# EAGLE design CocoLink (EAGLE 7.7.0)

## Sheet 1 of 4: LOGIC
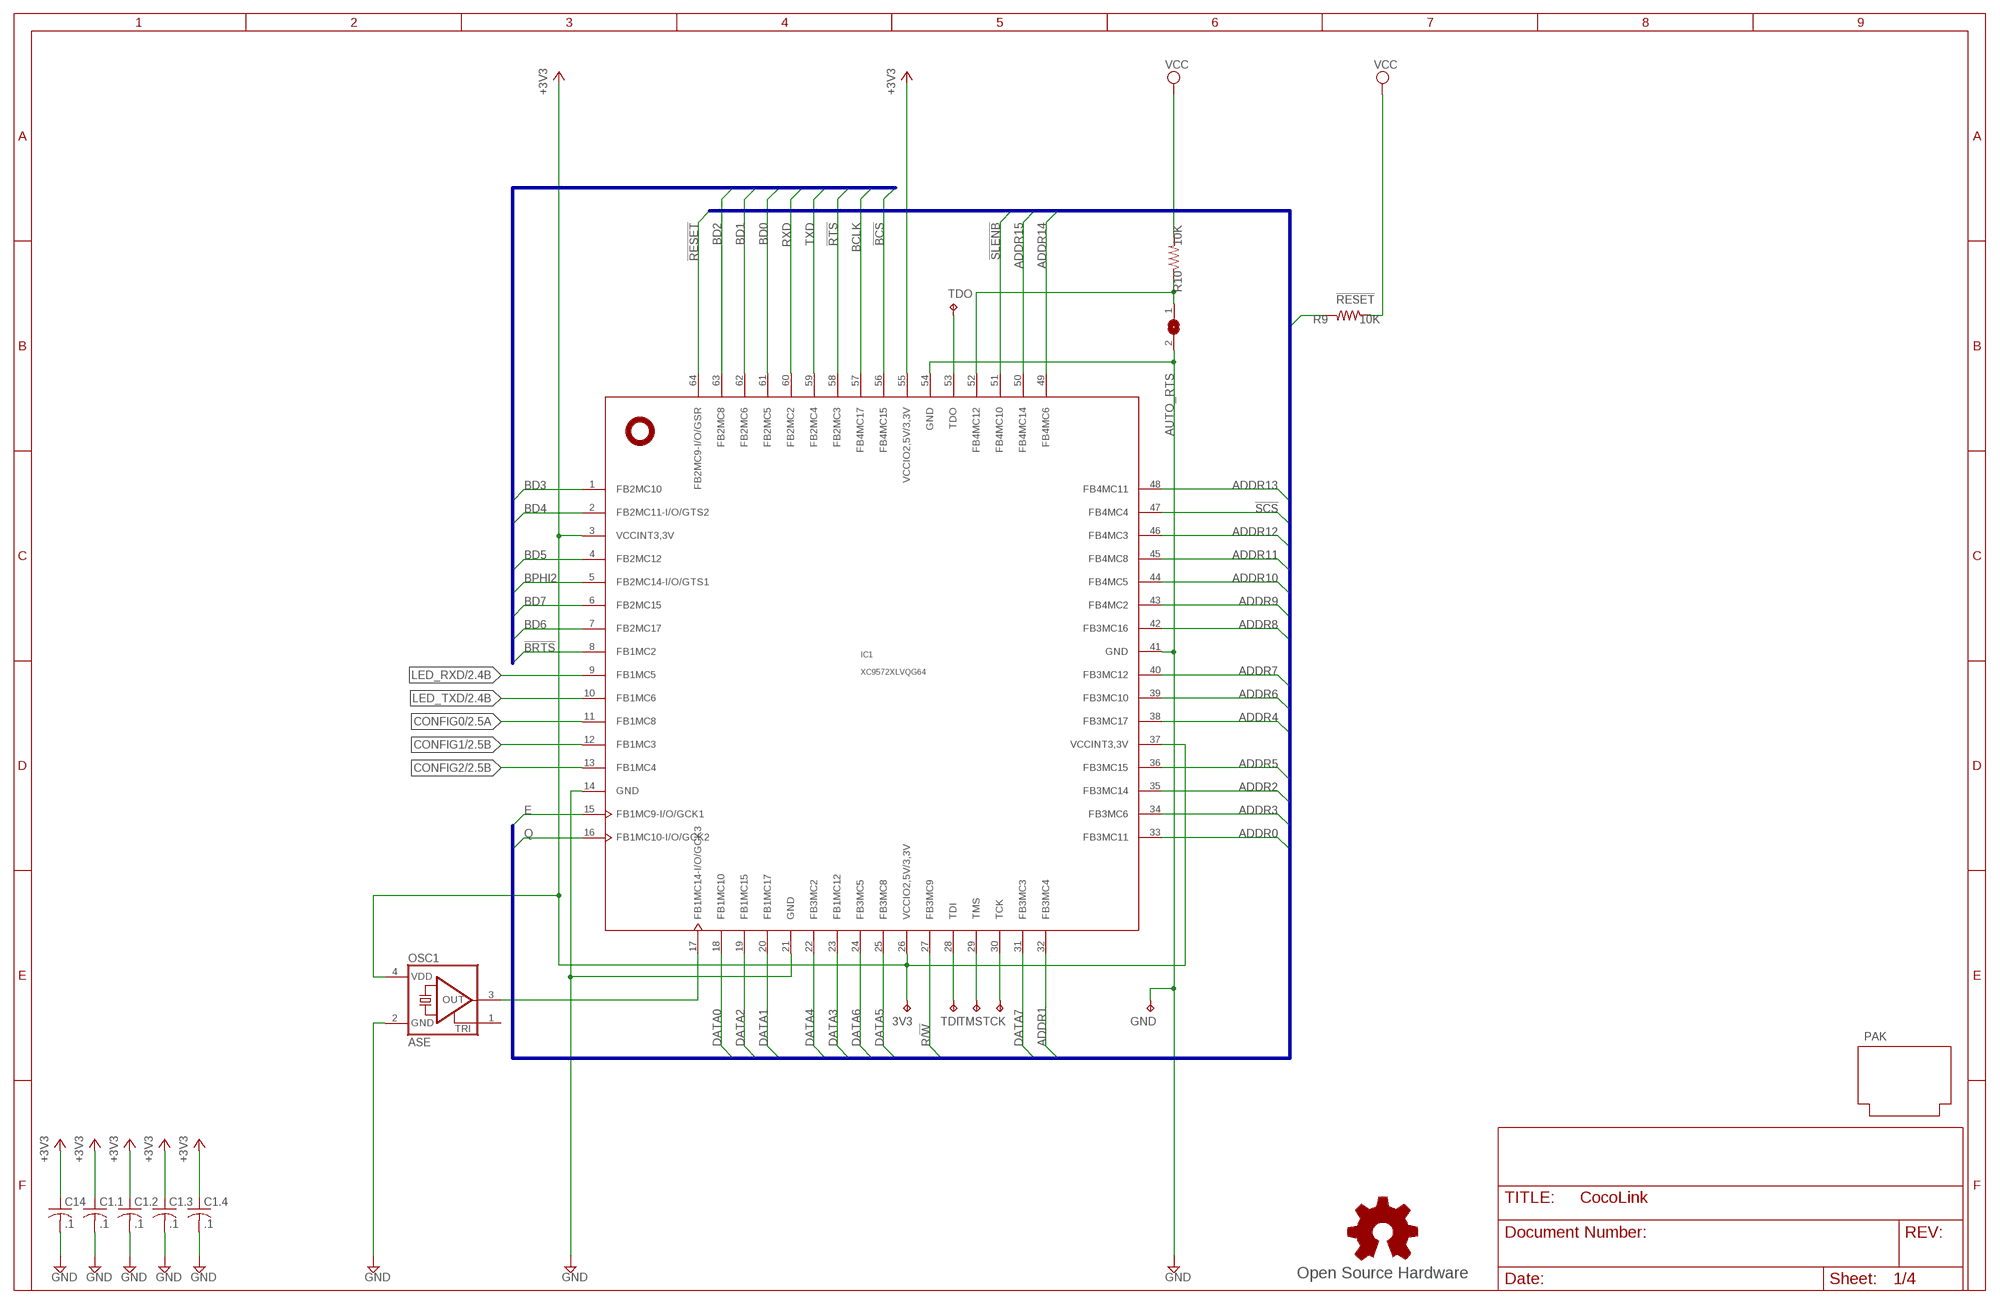
[diagram p0: schematic, sheet 1]

### Parts
3V3  TPTP10R  [TP10R]
AUTO_RTS  SJ  [SJ]
C1.1  .1  C-USC0402  [C0402]
C1.2  .1  C-USC0402  [C0402]
C1.3  .1  C-USC0402  [C0402]
C1.4  .1  C-USC0402  [C0402]
C14  .1  C-USC0402  [C0402]
GND  TPTP10R  [TP10R]
GOLD_ORB_SM1  Open Source Hardware  OSHWLOGOLOGO8MM  [OSHW_8MM]
IC1  XC9572XLVQG64  [VQFP64]
OSC1  ASE  [ASE]
PAK  PROGRAM_PAK  [PROGRAM_PAK]
R9  10K  R-US_R0402  [R0402]
R10  10K  R-US_R0402  [R0402]
TCK  TPTP10R  [TP10R]
TDI  TPTP10R  [TP10R]
TDO  TPTP10R  [TP10R]
TMS  TPTP10R  [TP10R]

### Nets
!BCS: IC1.56(FB4MC15) ; also sheet 3
!BRTS: IC1.8(FB1MC2) ; also sheet 3
!RESET: IC1.64(FB2MC9-I/O/GSR) R9.1 ; also sheet 2,3
!RTS: IC1.58(FB2MC3) ; also sheet 3
!SCS: IC1.47(FB4MC4) ; also sheet 2
!SLENB: IC1.51(FB4MC10) ; also sheet 2
+3V3: 3V3.TP C1.1.1 C1.2.1 C1.3.1 C1.4.1 C14.1 IC1.3(VCCINT3,3V) IC1.26(VCCIO2,5V/3,3V) IC1.37(VCCINT3,3V) IC1.55(VCCIO2,5V/3,3V) OSC1.4(VDD) ; also sheet 2,4
ADDR0: IC1.33(FB3MC11) ; also sheet 2,3
ADDR1: IC1.32(FB3MC4) ; also sheet 2,3
ADDR2: IC1.35(FB3MC14) ; also sheet 2
ADDR3: IC1.34(FB3MC6) ; also sheet 2
ADDR4: IC1.38(FB3MC17) ; also sheet 2
ADDR5: IC1.36(FB3MC15) ; also sheet 2
ADDR6: IC1.39(FB3MC10) ; also sheet 2
ADDR7: IC1.40(FB3MC12) ; also sheet 2
ADDR8: IC1.42(FB3MC16) ; also sheet 2
ADDR9: IC1.43(FB4MC2) ; also sheet 2
ADDR10: IC1.44(FB4MC5) ; also sheet 2
ADDR11: IC1.45(FB4MC8) ; also sheet 2
ADDR12: IC1.46(FB4MC3) ; also sheet 2
ADDR13: IC1.48(FB4MC11) ; also sheet 2
ADDR14: IC1.49(FB4MC6) ; also sheet 2
ADDR15: IC1.50(FB4MC14) ; also sheet 2
BCLK: IC1.57(FB4MC17) ; also sheet 3
BD0: IC1.61(FB2MC5) ; also sheet 3
BD1: IC1.62(FB2MC6) ; also sheet 3
BD2: IC1.63(FB2MC8) ; also sheet 3
BD3: IC1.1(FB2MC10) ; also sheet 3
BD4: IC1.2(FB2MC11-I/O/GTS2) ; also sheet 3
BD5: IC1.4(FB2MC12) ; also sheet 3
BD6: IC1.7(FB2MC17) ; also sheet 3
BD7: IC1.6(FB2MC15) ; also sheet 3
BPHI2: IC1.5(FB2MC14-I/O/GTS1) ; also sheet 3
CONFIG0: IC1.11(FB1MC8) ; also sheet 2
CONFIG1: IC1.12(FB1MC3) ; also sheet 2
CONFIG2: IC1.13(FB1MC4) ; also sheet 2
DATA0: IC1.18(FB1MC10) ; also sheet 2
DATA1: IC1.20(FB1MC17) ; also sheet 2
DATA2: IC1.19(FB1MC15) ; also sheet 2
DATA3: IC1.23(FB1MC12) ; also sheet 2
DATA4: IC1.22(FB3MC2) ; also sheet 2
DATA5: IC1.25(FB3MC8) ; also sheet 2
DATA6: IC1.24(FB3MC5) ; also sheet 2
DATA7: IC1.31(FB3MC3) ; also sheet 2
E: IC1.15(FB1MC9-I/O/GCK1) ; also sheet 2
GND: AUTO_RTS.2 C1.1.2 C1.2.2 C1.3.2 C1.4.2 C14.2 GND.TP IC1.14(GND) IC1.21(GND) IC1.41(GND) IC1.54(GND) OSC1.2(GND) ; also sheet 2,3,4
LED_RXD: IC1.9(FB1MC5) ; also sheet 2
LED_TXD: IC1.10(FB1MC6) ; also sheet 2
N$1: IC1.53(TDO) TDO.TP
N$2: IC1.28(TDI) TDI.TP
N$3: IC1.29(TMS) TMS.TP
N$4: IC1.30(TCK) TCK.TP
N$7: IC1.17(FB1MC14-I/O/GCK3) OSC1.3(OUT)
N$14: AUTO_RTS.1 IC1.52(FB4MC12) R10.1
Q: IC1.16(FB1MC10-I/O/GCK2) ; also sheet 2
R/!W: IC1.27(FB3MC9) ; also sheet 2,3
RXD: IC1.60(FB2MC2) ; also sheet 3
TXD: IC1.59(FB2MC4) ; also sheet 3
VCC: R9.2 R10.2 ; also sheet 3,4
Unconnected: OSC1.1(TRI)

### Buses
ADDR[0..15],DATA[0..7],R/!W,!NMI,!RESET,E,Q,!SLENB,!HALT,SND,!CART,!SCS,!CTS
!BRESET,BD[0..7],RS[0..1],!BIRQ,!BR/W,!BCS,BCLK,BPHI2,TXD,RXD,!RTS,!BRTS

## Sheet 2 of 4: IO
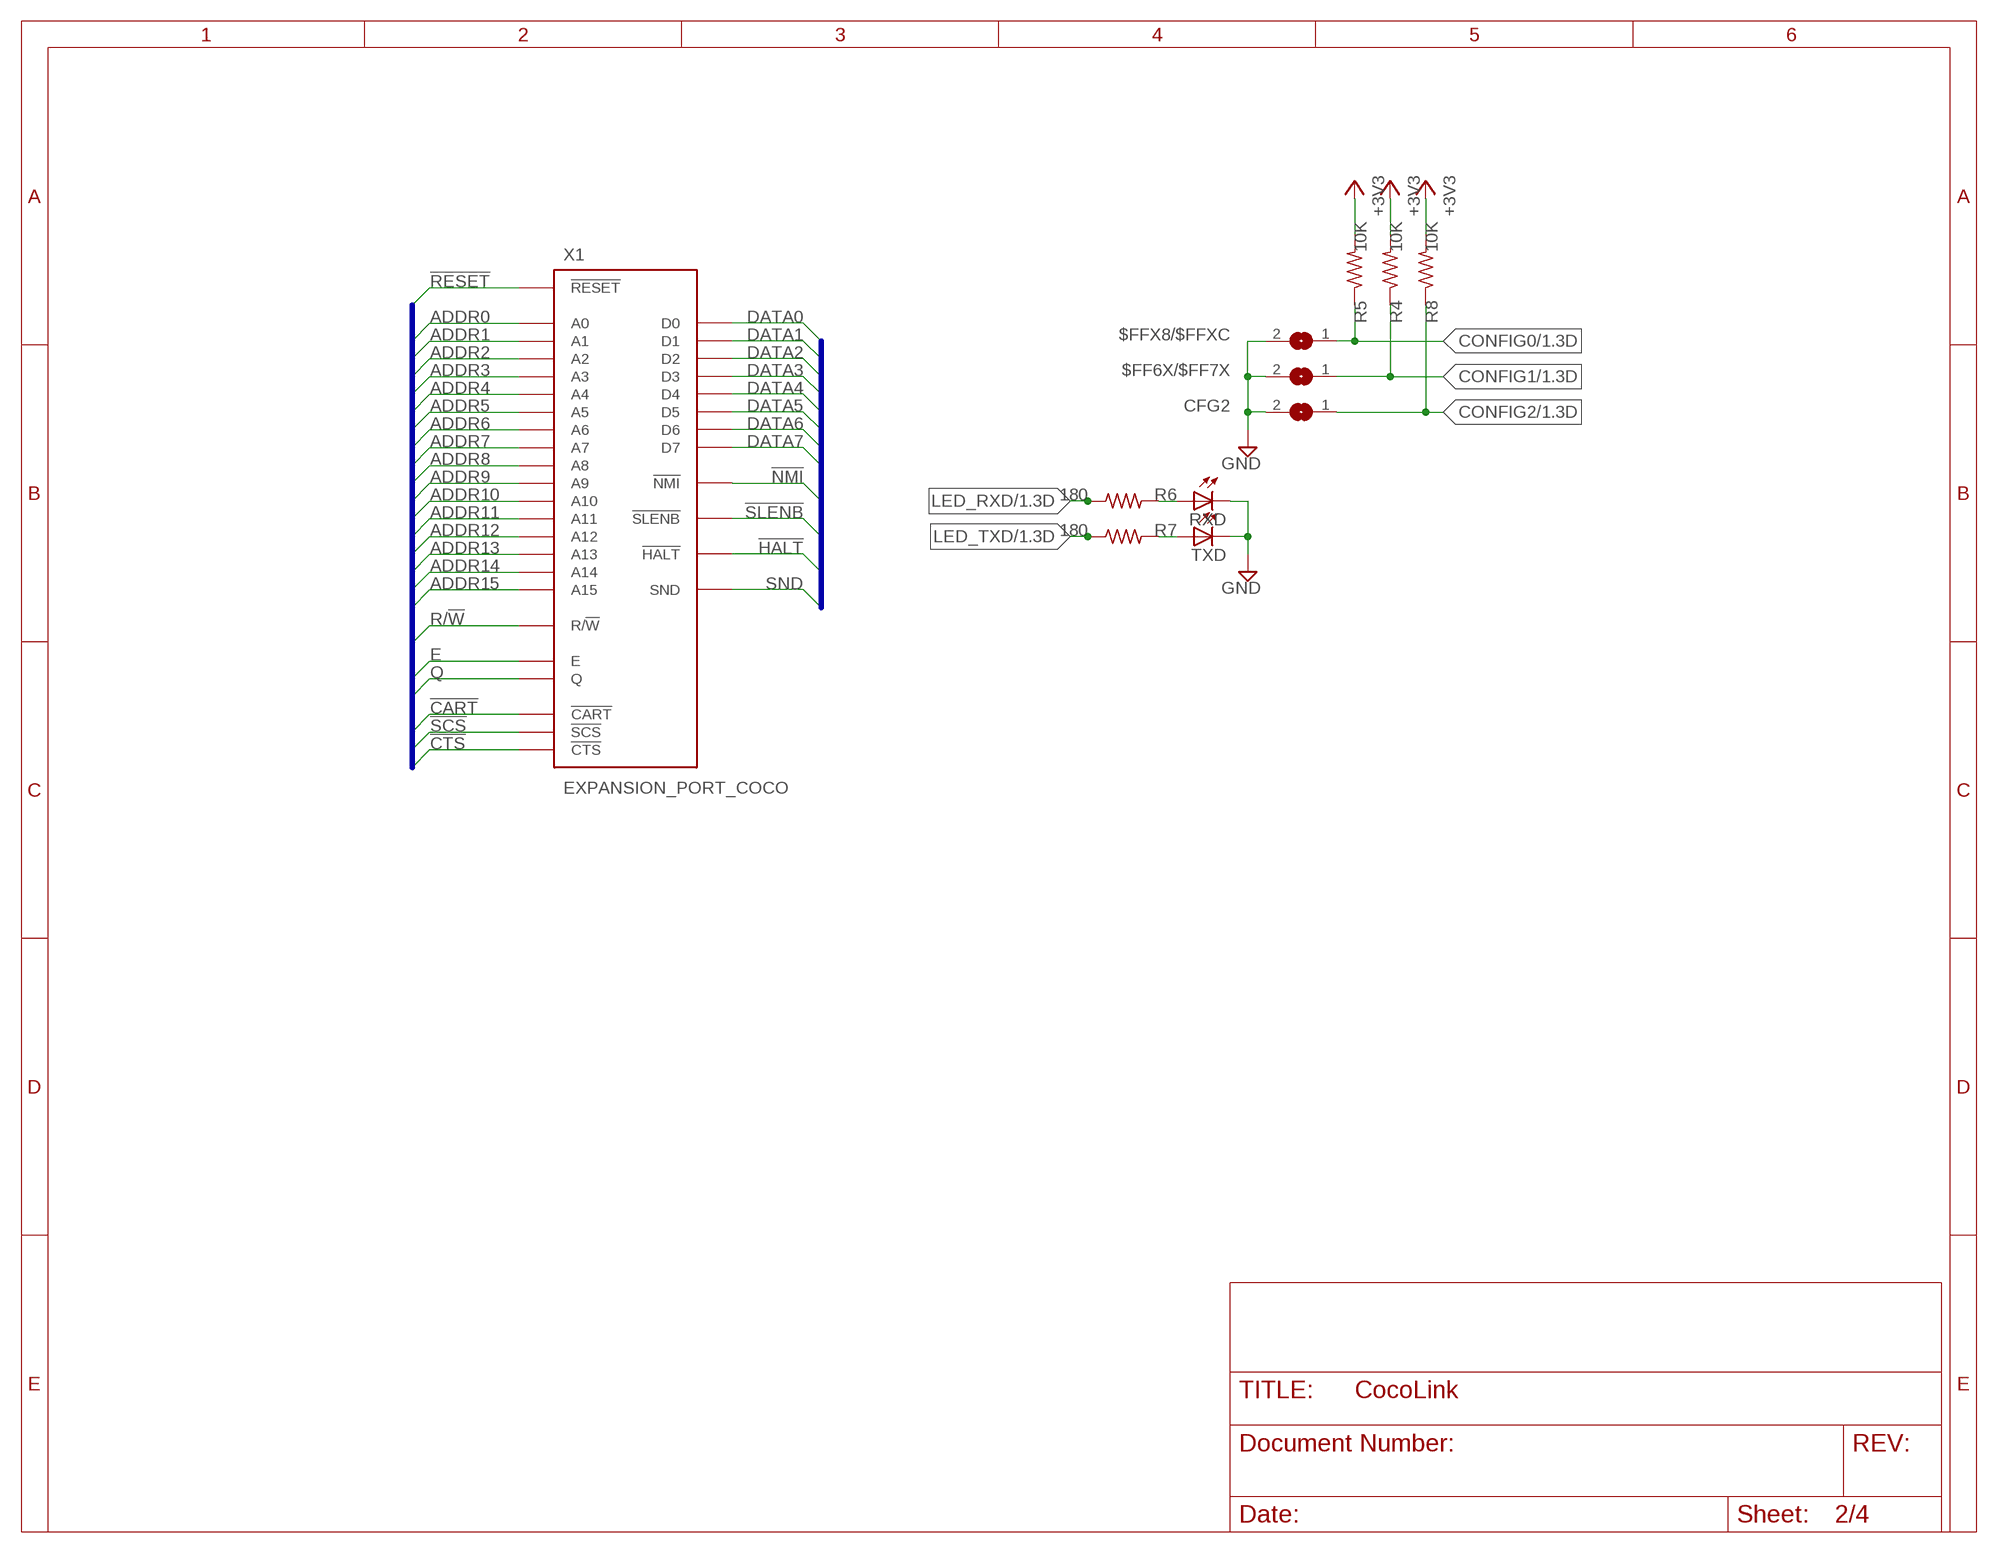
[diagram p1: schematic, sheet 2]

### Parts
$FF6X/$FF7X  SJ  [SJ]
$FFX8/$FFXC  SJ  [SJ]
CFG2  SJ  [SJ]
R4  10K  R-US_R0402  [R0402]
R5  10K  R-US_R0402  [R0402]
R6  180  R-US_R0402  [R0402]
R7  180  R-US_R0402  [R0402]
R8  10K  R-US_R0402  [R0402]
RXD  LED3MM  [LED3MM]
TXD  LED3MM  [LED3MM]
X1  EXPANSION_PORT_COCO  [MA20-2]

### Nets
!CART: X1.8(!CART) ; also sheet 3
!CTS: X1.32(!CTS)
!HALT: X1.3(!HALT)
!NMI: X1.4(!NMI)
!RESET: X1.5(!RESET) ; also sheet 1,3
!SCS: X1.36(!SCS) ; also sheet 1
!SLENB: X1.40(!SLENB) ; also sheet 1
+3V3: R4.2 R5.2 R8.2 ; also sheet 1,4
ADDR0: X1.19(A0) ; also sheet 1,3
ADDR1: X1.20(A1) ; also sheet 1,3
ADDR2: X1.21(A2) ; also sheet 1
ADDR3: X1.22(A3) ; also sheet 1
ADDR4: X1.23(A4) ; also sheet 1
ADDR5: X1.24(A5) ; also sheet 1
ADDR6: X1.25(A6) ; also sheet 1
ADDR7: X1.26(A7) ; also sheet 1
ADDR8: X1.27(A8) ; also sheet 1
ADDR9: X1.28(A9) ; also sheet 1
ADDR10: X1.29(A10) ; also sheet 1
ADDR11: X1.30(A11) ; also sheet 1
ADDR12: X1.31(A12) ; also sheet 1
ADDR13: X1.37(A13) ; also sheet 1
ADDR14: X1.38(A14) ; also sheet 1
ADDR15: X1.39(A15) ; also sheet 1
CONFIG0: $FFX8/$FFXC.1 R5.1 ; also sheet 1
CONFIG1: $FF6X/$FF7X.1 R4.1 ; also sheet 1
CONFIG2: CFG2.1 R8.1 ; also sheet 1
DATA0: X1.10(D0) ; also sheet 1
DATA1: X1.11(D1) ; also sheet 1
DATA2: X1.12(D2) ; also sheet 1
DATA3: X1.13(D3) ; also sheet 1
DATA4: X1.14(D4) ; also sheet 1
DATA5: X1.15(D5) ; also sheet 1
DATA6: X1.16(D6) ; also sheet 1
DATA7: X1.17(D7) ; also sheet 1
E: X1.6(E) ; also sheet 1
GND: $FF6X/$FF7X.2 $FFX8/$FFXC.2 CFG2.2 RXD.K(C) TXD.K(C) ; also sheet 1,3,4
LED_RXD: R6.1 ; also sheet 1
LED_TXD: R7.1 ; also sheet 1
N$26: R7.2 TXD.A
N$27: R6.2 RXD.A
Q: X1.7(Q) ; also sheet 1
R/!W: X1.18(R/!W) ; also sheet 1,3
SND: X1.35(SND)

### Buses
ADDR[0..15],DATA[0..7],R/!W,!NMI,!RESET,E,Q,!SLENB,!HALT,SND,!CART,!SCS,!CTS

## Sheet 3 of 4: SERIAL
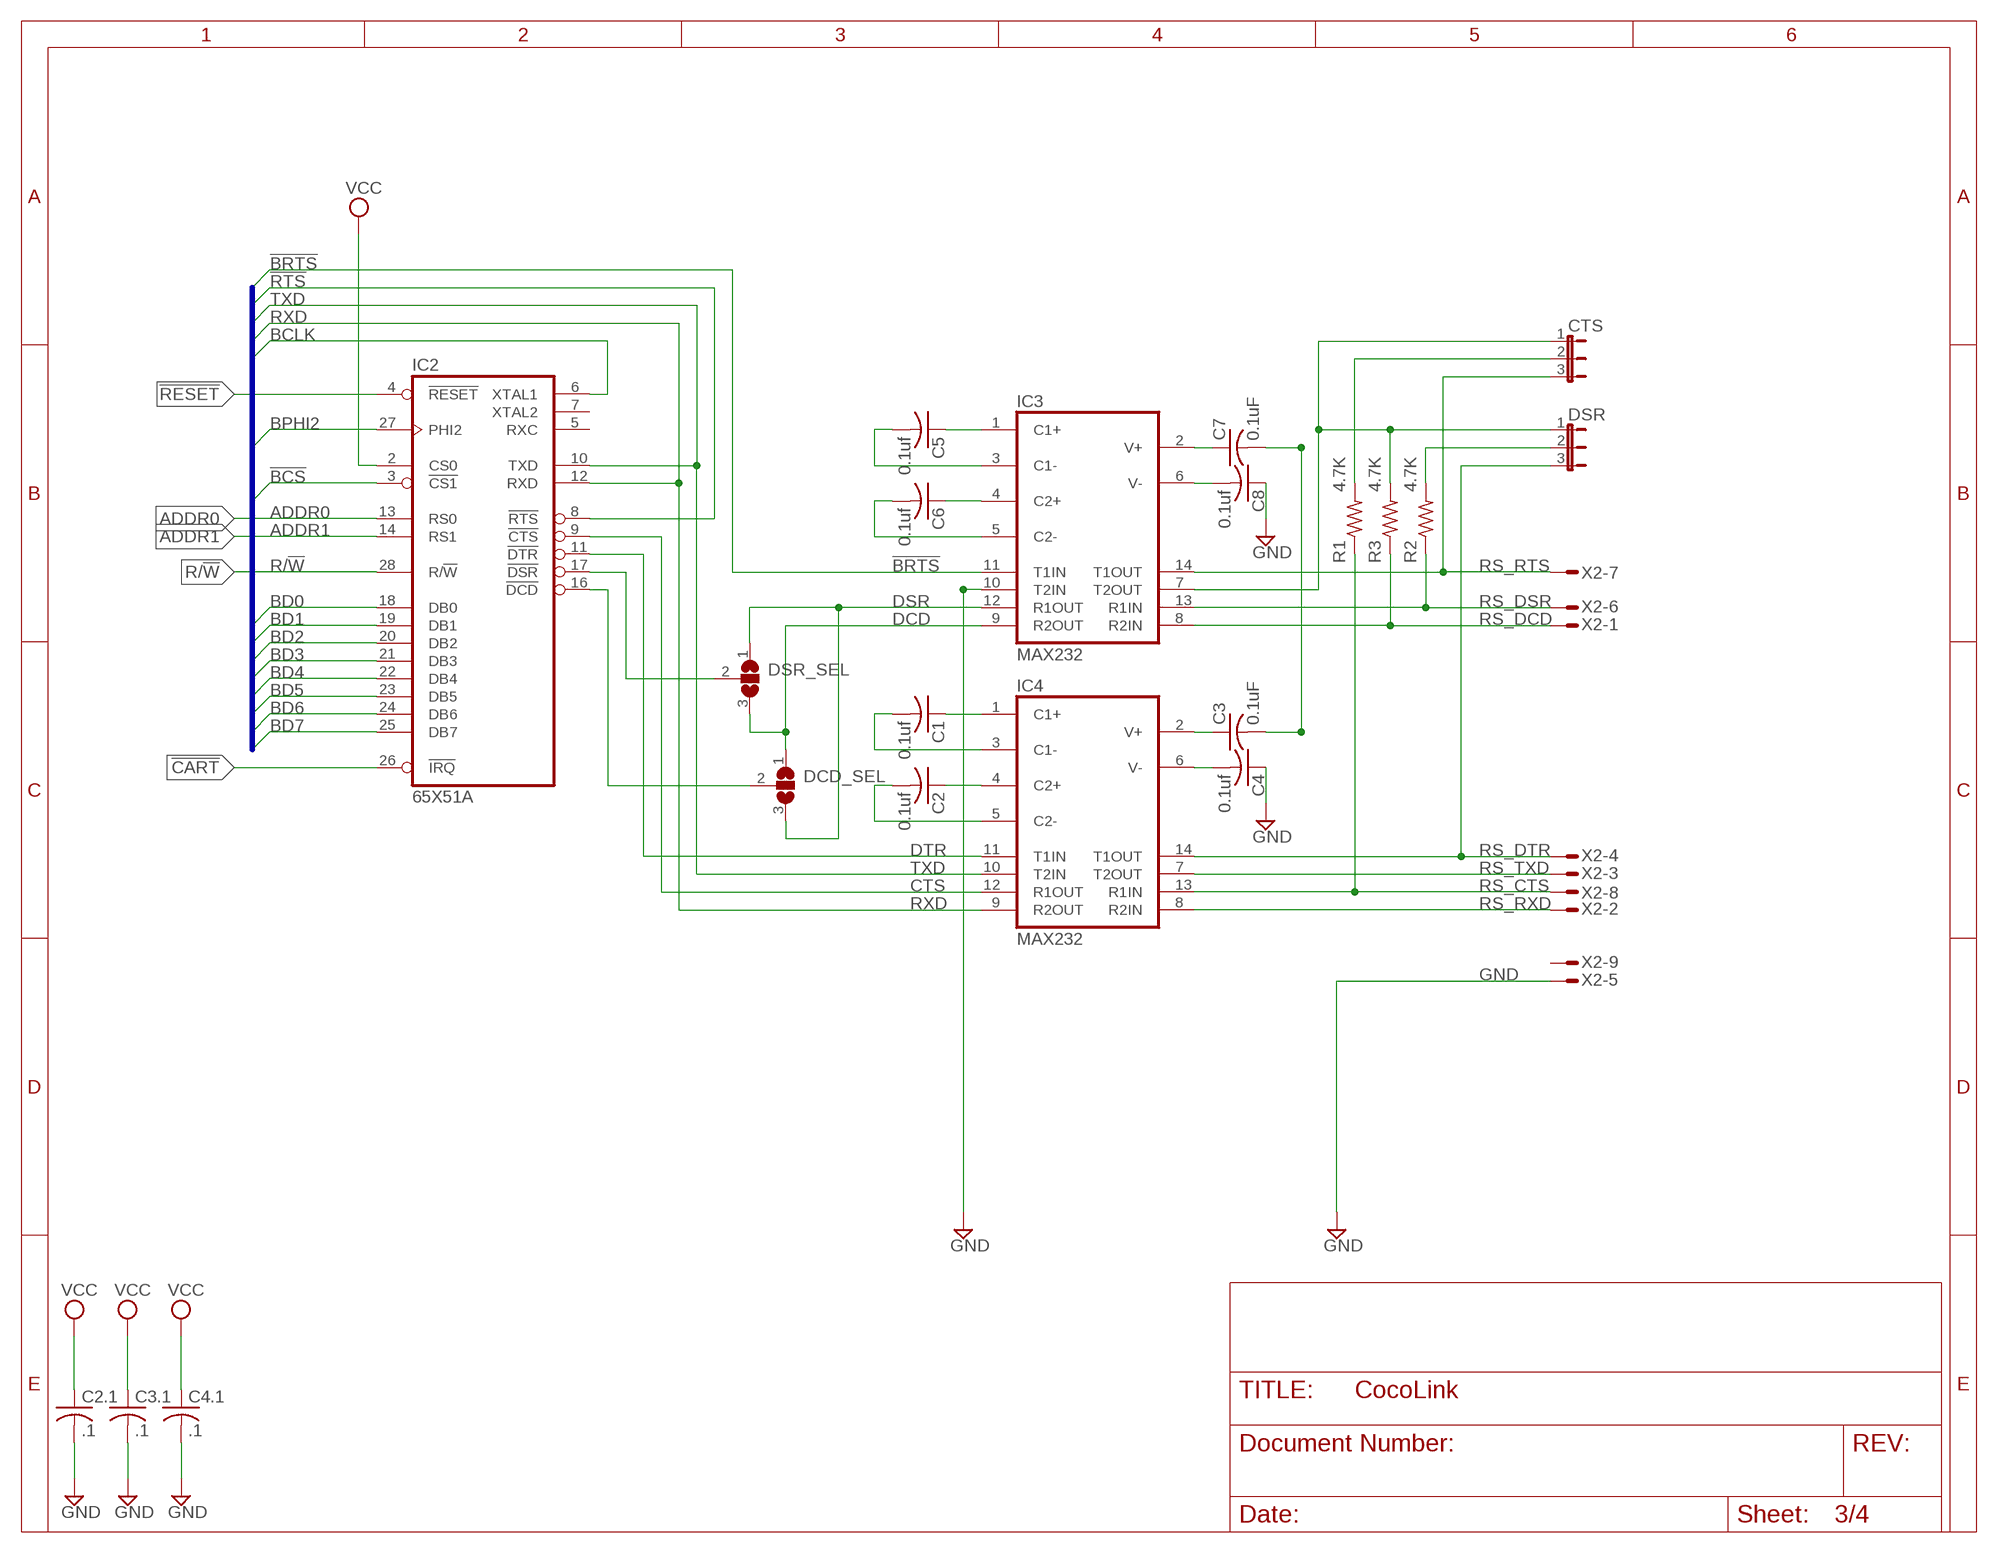
[diagram p2: schematic, sheet 3]

### Parts
C1  0.1uf  C-USC0402  [C0402]
C2  0.1uf  C-USC0402  [C0402]
C2.1  .1  C-USC0402  [C0402]
C3  0.1uF  C-USC0402  [C0402]
C3.1  .1  C-USC0402  [C0402]
C4  0.1uf  C-USC0402  [C0402]
C4.1  .1  C-USC0402  [C0402]
C5  0.1uf  C-USC0402  [C0402]
C6  0.1uf  C-USC0402  [C0402]
C7  0.1uF  C-USC0402  [C0402]
C8  0.1uf  C-USC0402  [C0402]
CTS  JP2E  [JP2]
DCD_SEL  SJ2W  [SJ_2]
DSR  JP2E  [JP2]
DSR_SEL  SJ2W  [SJ_2]
IC2  65X51A  6551NR  [DIL28-ROUNDPAD]
IC3  MAX232  MAX3232CSE  [SO16]
IC4  MAX232  MAX3232CSE  [SO16]
R1  4.7K  R-US_R1206  [R1206]
R2  4.7K  R-US_R1206  [R1206]
R3  4.7K  R-US_R1206  [R1206]
X2  M09DS  [M09D]

### Nets
!BCS: IC2.3(!CS1) ; also sheet 1
!BRTS: IC3.11(T1IN) ; also sheet 1
!CART: IC2.26(!IRQ) ; also sheet 2
!RESET: IC2.4(!RESET) ; also sheet 1,2
!RTS: IC2.8(!RTS) ; also sheet 1
ACIA_DCD: DCD_SEL.2 IC2.16(!DCD)
ACIA_DSR: DSR_SEL.2 IC2.17(!DSR)
ADDR0: IC2.13(RS0) ; also sheet 1,2
ADDR1: IC2.14(RS1) ; also sheet 1,2
BCLK: IC2.6(XTAL1) ; also sheet 1
BD0: IC2.18(DB0) ; also sheet 1
BD1: IC2.19(DB1) ; also sheet 1
BD2: IC2.20(DB2) ; also sheet 1
BD3: IC2.21(DB3) ; also sheet 1
BD4: IC2.22(DB4) ; also sheet 1
BD5: IC2.23(DB5) ; also sheet 1
BD6: IC2.24(DB6) ; also sheet 1
BD7: IC2.25(DB7) ; also sheet 1
BPHI2: IC2.27(PHI2) ; also sheet 1
CTS: IC2.9(!CTS) IC4.12(R1OUT)
DCD: DCD_SEL.1 DSR_SEL.3 IC3.9(R2OUT)
DSR: DCD_SEL.3 DSR_SEL.1 IC3.12(R1OUT)
DTR: IC2.11(!DTR) IC4.11(T1IN)
GND: C2.1.2 C3.1.2 C4.1 C4.1.2 C8.1 IC3.10(T2IN) X2.5 ; also sheet 1,2,4
N$10: DSR.2 R2.2
N$11: CTS.1 DSR.1 IC3.7(T2OUT) R3.2
N$12: CTS.2 R1.2
N$13: C1.1 IC4.1(C1+)
N$17: C1.2 IC4.3(C1-)
N$18: C2.1 IC4.4(C2+)
N$19: C2.2 IC4.5(C2-)
N$20: C3.1 IC4.2(V+)
N$21: C4.2 IC4.6(V-)
N$22: C5.1 IC3.1(C1+)
N$23: C5.2 IC3.3(C1-)
N$24: C6.1 IC3.4(C2+)
N$34: C6.2 IC3.5(C2-)
N$36: C7.1 IC3.2(V+)
N$37: C8.2 IC3.6(V-)
R/!W: IC2.28(R/!W) ; also sheet 1,2
RS_CTS: IC4.13(R1IN) R1.1 X2.8
RS_DCD: IC3.13(R1IN) R2.1 X2.6
RS_DSR: IC3.8(R2IN) R3.1 X2.1
RS_DTR: DSR.3 IC4.14(T1OUT) X2.4
RS_RTS: CTS.3 IC3.14(T1OUT) X2.7
RS_RXD: IC4.8(R2IN) X2.2
RS_TXD: IC4.7(T2OUT) X2.3
RXD: IC2.12(RXD) IC4.9(R2OUT) ; also sheet 1
TXD: IC2.10(TXD) IC4.10(T2IN) ; also sheet 1
VCC: C2.1.1 C3.1.1 C3.2 C4.1.1 C7.2 IC2.2(CS0) ; also sheet 1,4
Unconnected: IC2.5(RXC) IC2.7(XTAL2) X2.9

### Buses
B$1

## Sheet 4 of 4: POWER
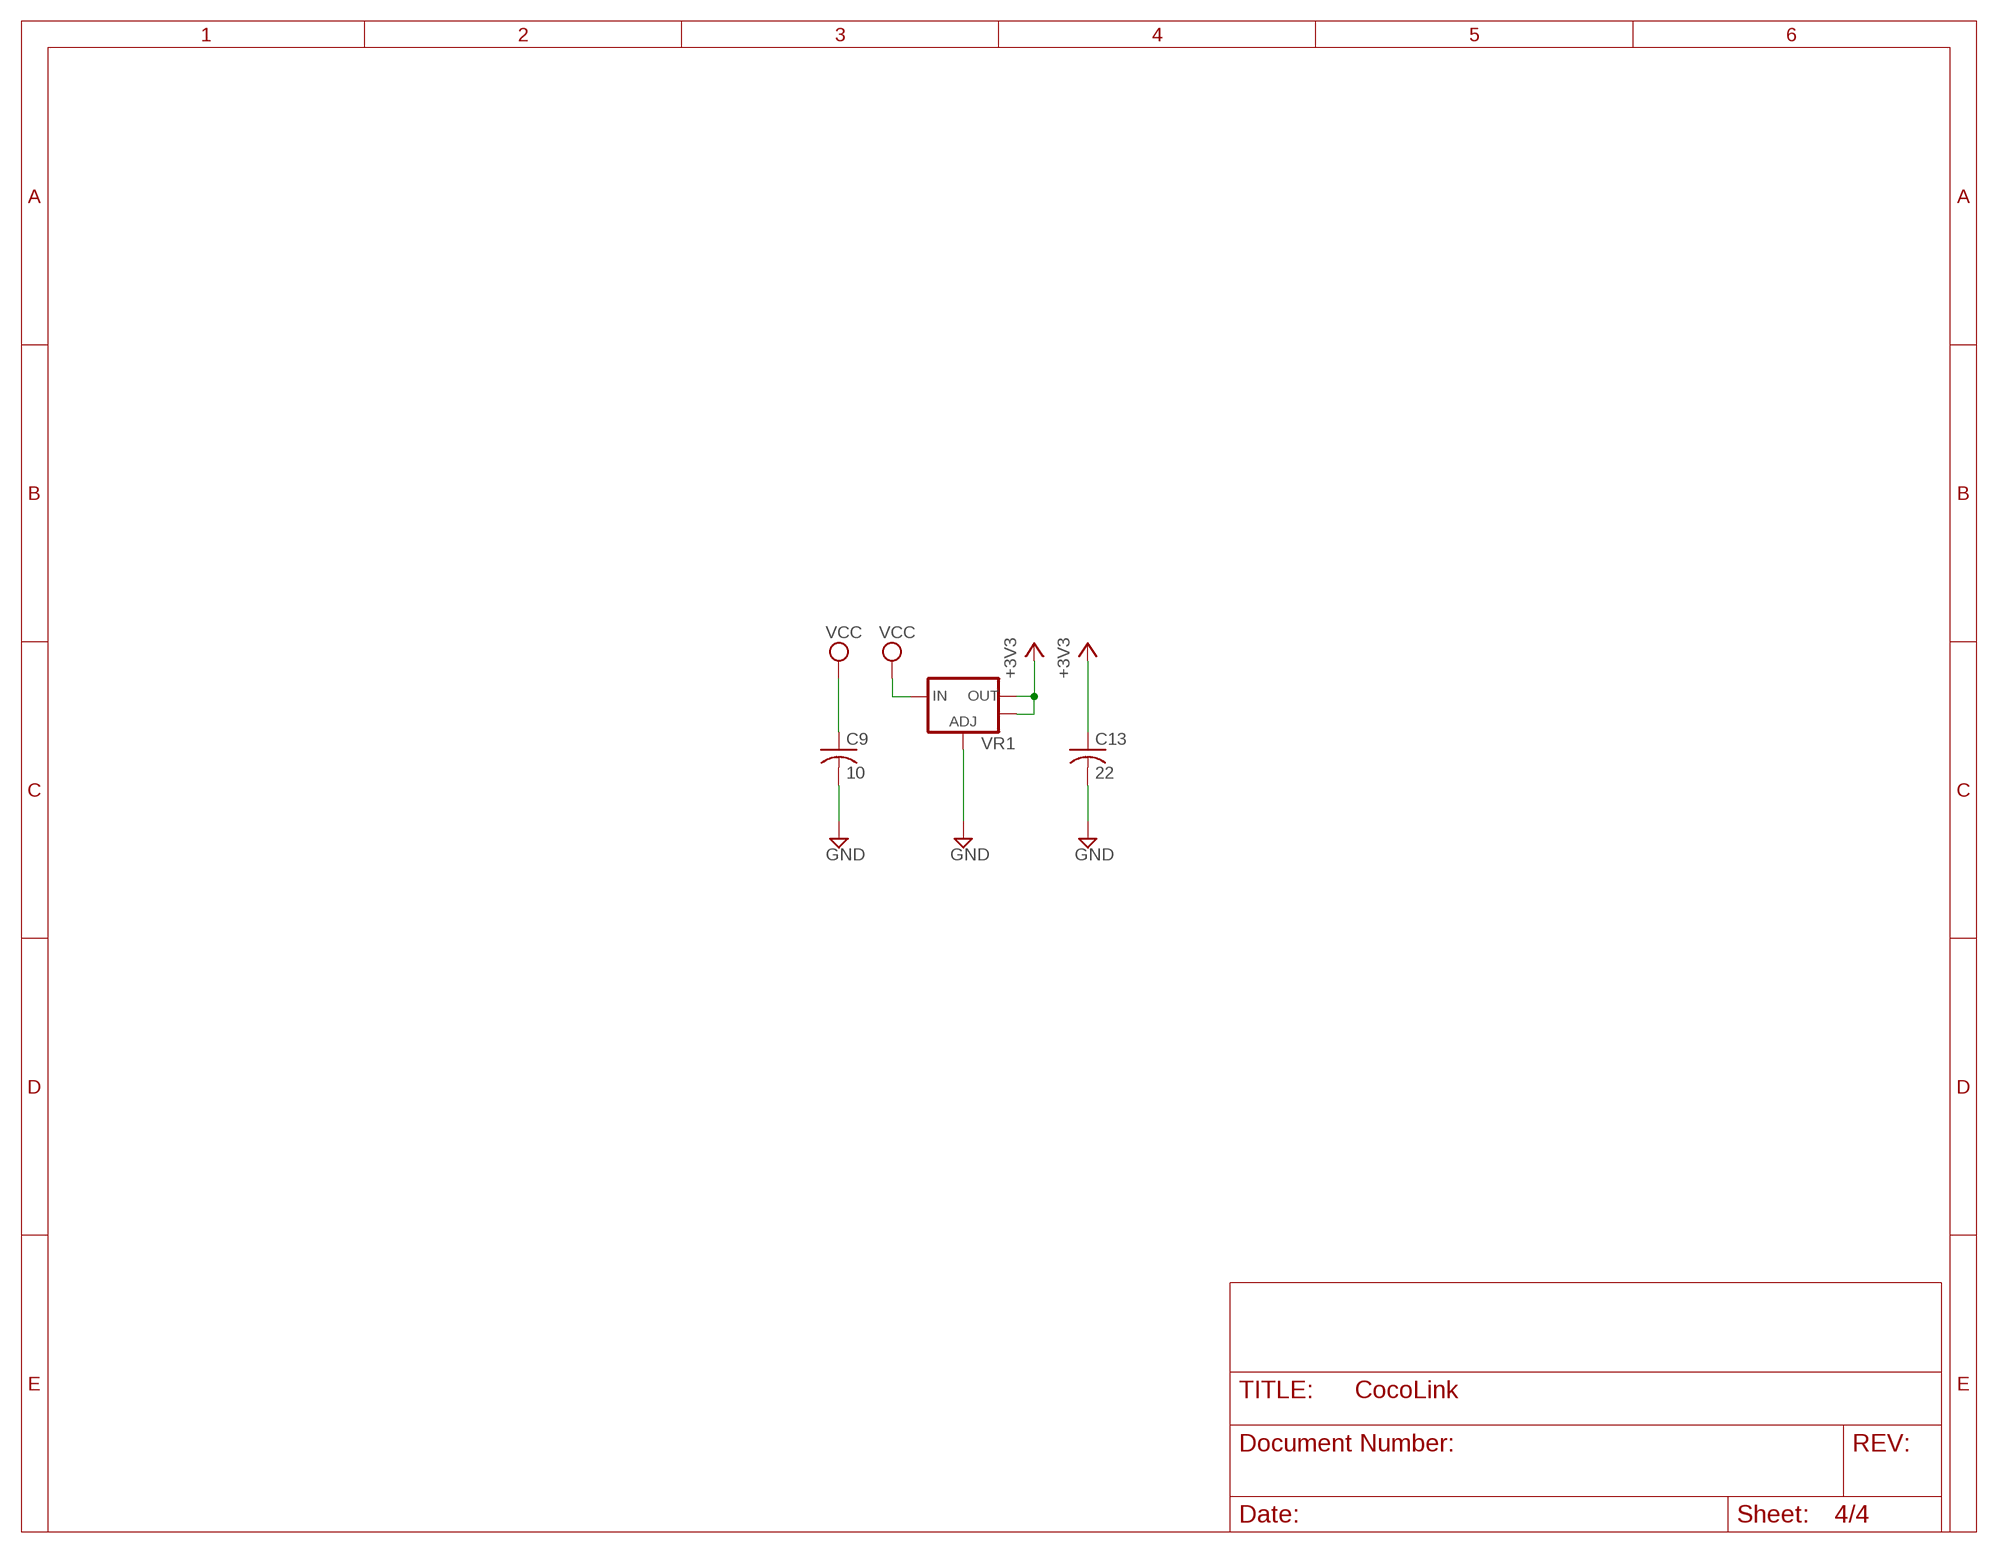
[diagram p3: schematic, sheet 4]

### Parts
C9  10  C-USC0805  [C0805]
C13  22  C-USC0805  [C0805]
VR1  V_REG_LM1117SOT223  [SOT223]

### Nets
+3V3: C13.1 VR1.2(OUT) VR1.4(OUT) ; also sheet 1,2
GND: C9.2 C13.2 VR1.1(ADJ) ; also sheet 1,2,3
VCC: C9.1 VR1.3(IN) ; also sheet 1,3

## Power pins joined to a net without a drawn wire
+12V: X1.2(+12V)
-12V: X1.1(-12V)
GND: IC2.1(GND) IC3.15(GND) IC4.15(GND) X1.33(GND) X1.34(GND)
VCC: IC2.15(VCC) IC3.16(VCC) IC4.16(VCC) X1.9(VCC)

## Library data of the parts
3V3 GND TCK TDI TDO TMS = testpad:TP: Test pad
$FF6X/$FF7X $FFX8/$FFXC AUTO_RTS CFG2 = jumper:SJ: SMD solder JUMPER
C1-C8 = resistor:C-US: CAPACITOR, American symbol
C1.1-C1.4 C2.1 C3.1 C4.1 C9 C13 C14 = rcl:C-US: CAPACITOR, American symbol
CTS DSR = jumper:JP2E: JUMPER
DCD_SEL DSR_SEL = jumper:SJ2W: SMD solder JUMPER
GOLD_ORB_SM1 = oshw:OSHWLOGO: The OSHW logo for PCB layout
IC1 = xilinx_xc95XXXxl:XC9572XLVQG64
IC2 = commodore:65*51: ACIA. Capable of RS-232
IC3 IC4 = maxim:MAX3232*: True RS-232 Transceivers 3.0V to 5.5V, Low-Power up to 1Mbps, Using Four 0.1µF External Capacitors Source: http://pdfserv.maxim-ic.com/en/ds/MAX3222-MAX3241.pdf; MPN: MAX3232CSE; OC_FARNELL: 9725490; OC_NEWARK: 90C2890
OSC1 = crystal:ASE: 3.3Vdc CMOS SMD CRYSTAL CLOCK OSCILLATOR SOurce: www.abracon.com; OC_FARNELL: unknown; OC_NEWARK: unknown
PAK = coco:PROGRAM_PAK
R1-R3 = rcl:R-US_: RESISTOR, American symbol
R4-R10 = resistor:R-US_: RESISTOR, American symbol
RXD TXD = led:LED: LED OSRAM: - CHIPLED LG R971, LG N971, LY N971, LG Q971, LY Q971, LO R971, LY R971 LH N974, LH R974 LS Q976, LO Q976, LY Q976 LO Q996 - Hyper CHIPLED LW Q18S LB Q993, LB Q99A, LB R99A - SideLED LS A670, LO A670, LY A670, LG A670, LP A670 LB A673, LV A673, LT A673, LW A673 LH A674 LY A675 LS A676, LA A676, LO A676, LY A676, LW A676 LS A679, LY A679, LG A679 - Hyper Micro SIDELED® LS Y876, LA Y876, LO Y876, LY Y876 LT Y87S - SmartLED LW L88C, LW L88S LB L89C, LB L89S, LG L890 LS L89K, LO L89K, LY L89K LS L896, LA L896, LO L896, LY L896 - TOPLED LS T670, LO T670, LY T670, LG T670, LP T670 LSG T670, LSP T670, LSY T670, LOP T670, LYG T670 LG T671, LOG T671, LSG T671 LB T673, LV T673, LT T673, LW T673 LH T674 LS T676, LA T676, LO T676, LY T676, LB T676, LH T676, LSB T676, LW T676 LB T67C, LV T67C, LT T67C, LS T67K, LO T67K, LY T67K, LW E67C LS E67B, LA E67B, LO E67B, LY E67B, LB E67C, LV E67C, LT E67C LW T67C LS T679, LY T679, LG T679 LS T770, LO T770, LY T770, LG T770, LP T770 LB T773, LV T773, LT T773, LW T773 LH T774 LS E675, LA E675, LY E675, LS T675 LS T776, LA T776, LO T776, LY T776, LB T776 LHGB T686 LT T68C, LB T68C - Hyper Mini TOPLED® LB M676 - Mini TOPLED Santana® LG M470 LS M47K, LO M47K, LY M47K Source: http://www.osram.convergy.de LUXEON: - LUMILED® LXK2-PW12-R00, LXK2-PW12-S00, LXK2-PW14-U00, LXK2-PW14-V00 LXK2-PM12-R00, LXK2-PM12-S00, LXK2-PM14-U00 LXK2-PE12-Q00, LXK2-PE12-R00, LXK2-PE12-S00, LXK2-PE14-T00, LXK2-PE14-U00 LXK2-PB12-K00, LXK2-PB12-L00, LXK2-PB12-M00, LXK2-PB14-N00, LXK2-PB14-P00, LXK2-PB14-Q00 LXK2-PR12-L00, LXK2-PR12-M00, LXK2-PR14-Q00, LXK2-PR14-R00 LXK2-PD12-Q00, LXK2-PD12-R00, LXK2-PD12-S00 LXK2-PH12-R00, LXK2-PH12-S00 LXK2-PL12-P00, LXK2-PL12-Q00, LXK2-PL12-R00 Source: www.luxeon.com KINGBRIGHT: KA-3528ASYC Source: www.kingbright.com
VR1 = SparkFun:V_REG_LM1117: Voltage Regulator LM1117 Standard adjustable voltage regulator but in SMD form. Spark Fun Electronics SKU : COM-00595
X1 = coco:EXPANSION_PORT_COCO
X2 = con-subd:M09?S: SUB-D; OC_FARNELL: unknown; OC_NEWARK: unknown

## Board
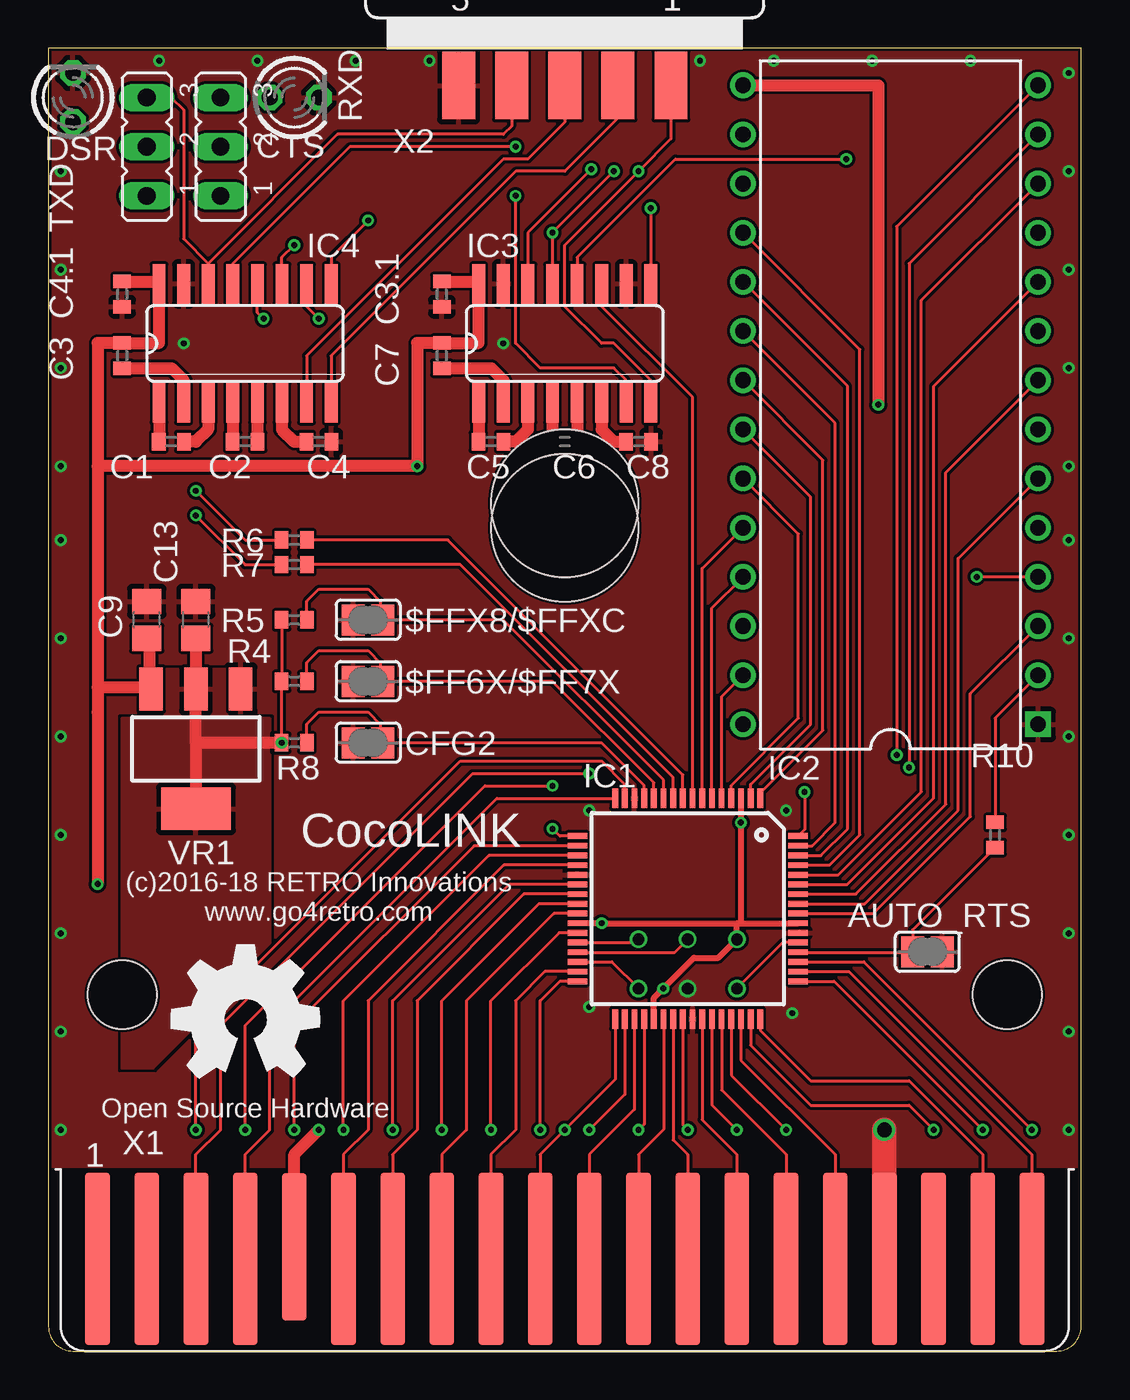
[diagram p4: board, top side]
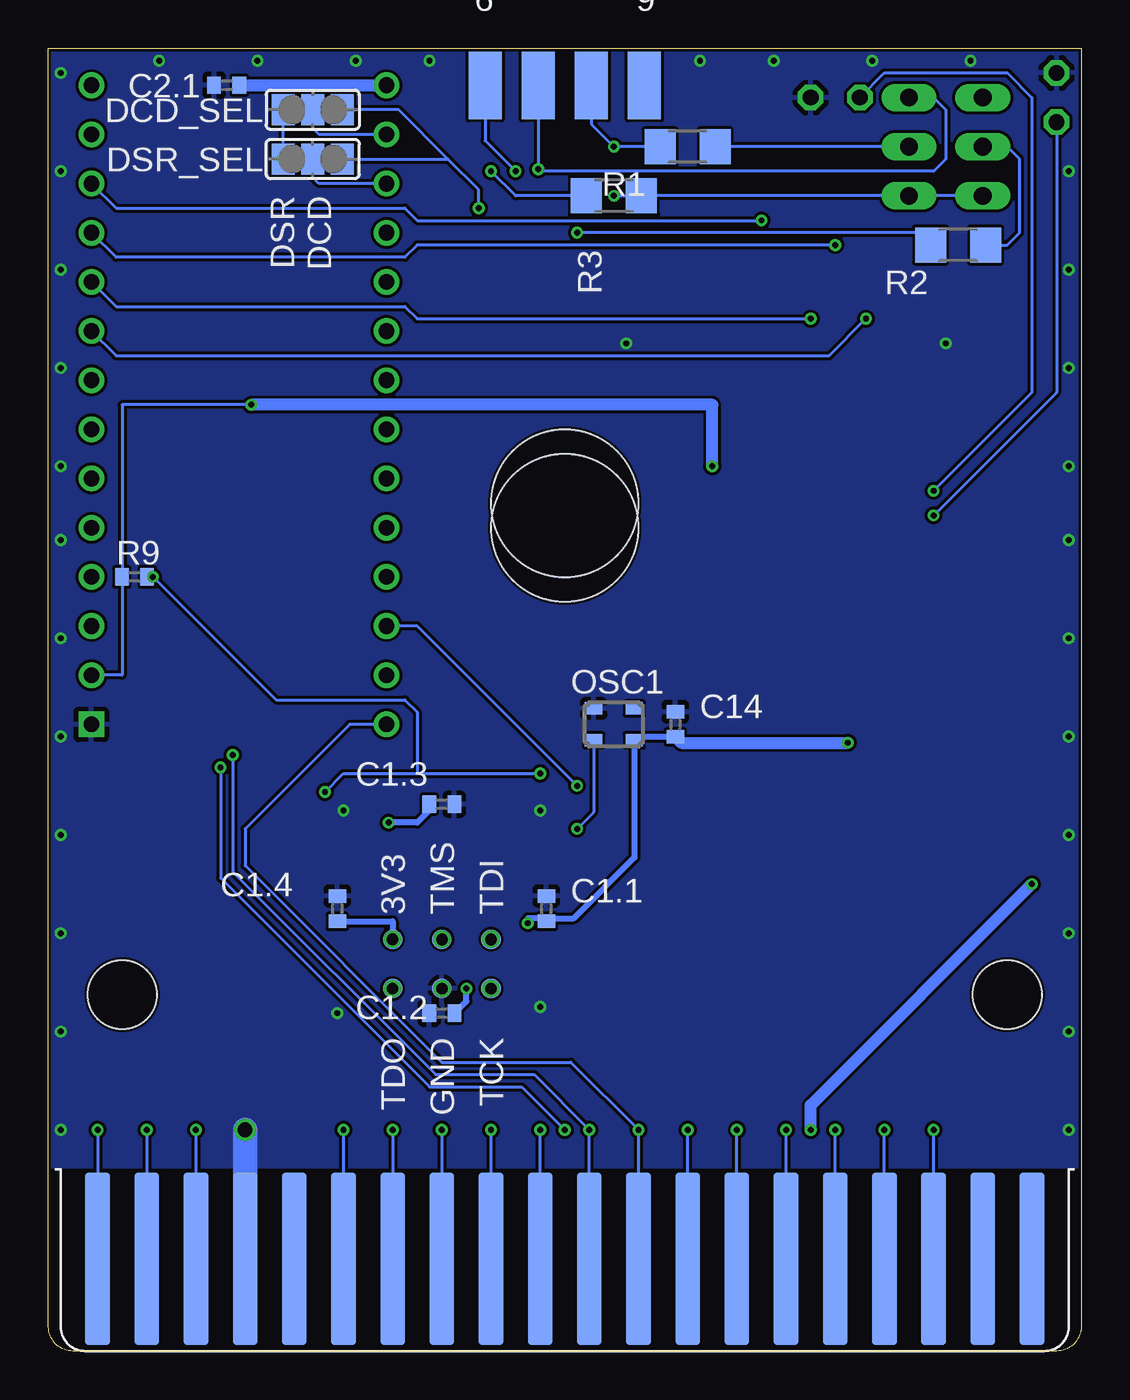
[diagram p5: board, bottom side, seen from below]

Size 53.34 x 67.31 mm. Coordinates in mm from the lower left corner, seen from the top.
Outline: 1.27,0 52.07,0 arc90 53.34,1.27 53.34,67.31 0,67.31 0,1.27 arc90 1.27,0
Copper layers (1*16): Top 0.035mm / dielectric 1.5mm / Bottom 0.035mm
Design rules "hackvana *": minimum track width 6mil, minimum drill 0.3mm, track to track 6mil, track to pad 6mil, pad to pad 6mil, via to via 6mil, smd to smd 0mil, copper to edge 6mil, drill to drill 6mil, minimum pad ring 10mil, minimum via ring 6mil, stop-mask expansion 2mil, vias tented up to drill 100mil, thermal gap 10mil

### Footprints (pad centres in the part's own frame; a part is rotated, then mirrored left to right if it is on the bottom)
TP10R = smd 1 x 1: TP 0,0
SJ = smd 1.168 x 1.6: 1 -0.762,0; 2 0.762,0
C0402 = smd 0.7 x 0.9: 1 -0.65,0; 2 0.65,0
C0805 = smd 1.3 x 1.5: 1 -0.95,0; 2 0.95,0
JP2 = drill 0.914 long: 1 -2.54,0; 2 0,0; 3 2.54,0
SJ_2 = smd 1.168 x 1.6: 1 -1.524,0; 2 0,0; 3 1.524,0
VQFP64 = smd 1 x 0.3: 1 -5.7,3.75; 2 -5.7,3.25; 3 -5.7,2.75; 4 -5.7,2.25; 5 -5.7,1.75; 6 -5.7,1.25; 7 -5.7,0.75; 8 -5.7,0.25; 9 -5.7,-0.25; 10 -5.7,-0.75; 11 -5.7,-1.25; 12 -5.7,-1.75; 13 -5.7,-2.25; 14 -5.7,-2.75; 15 -5.7,-3.25; 16 -5.7,-3.75; 33 5.7,-3.75; 34 5.7,-3.25; 35 5.7,-2.75; 36 5.7,-2.25; 37 5.7,-1.75; 38 5.7,-1.25; 39 5.7,-0.75; 40 5.7,-0.25; 41 5.7,0.25; 42 5.7,0.75; 43 5.7,1.25; 44 5.7,1.75; 45 5.7,2.25; 46 5.7,2.75; 47 5.7,3.25; 48 5.7,3.75 | smd 0.3 x 1: 17 -3.75,-5.7; 18 -3.25,-5.7; 19 -2.75,-5.7; 20 -2.25,-5.7; 21 -1.75,-5.7; 22 -1.25,-5.7; 23 -0.75,-5.7; 24 -0.25,-5.7; 25 0.25,-5.7; 26 0.75,-5.7; 27 1.25,-5.7; 28 1.75,-5.7; 29 2.25,-5.7; 30 2.75,-5.7; 31 3.25,-5.7; 32 3.75,-5.7; 49 3.75,5.7; 50 3.25,5.7; 51 2.75,5.7; 52 2.25,5.7; 53 1.75,5.7; 54 1.25,5.7; 55 0.75,5.7; 56 0.25,5.7; 57 -0.25,5.7; 58 -0.75,5.7; 59 -1.25,5.7; 60 -1.75,5.7; 61 -2.25,5.7; 62 -2.75,5.7; 63 -3.25,5.7; 64 -3.75,5.7
DIL28-ROUNDPAD = drill 0.813 square: 1 -16.51,-7.62 | drill 0.813: 2 -13.97,-7.62; 3 -11.43,-7.62; 4 -8.89,-7.62; 5 -6.35,-7.62; 6 -3.81,-7.62; 7 -1.27,-7.62; 8 1.27,-7.62; 9 3.81,-7.62; 10 6.35,-7.62; 11 8.89,-7.62; 12 11.43,-7.62; 13 13.97,-7.62; 14 16.51,-7.62; 15 16.51,7.62; 16 13.97,7.62; 17 11.43,7.62; 18 8.89,7.62; 19 6.35,7.62; 20 3.81,7.62; 21 1.27,7.62; 22 -1.27,7.62; 23 -3.81,7.62; 24 -6.35,7.62; 25 -8.89,7.62; 26 -11.43,7.62; 27 -13.97,7.62; 28 -16.51,7.62
SO16 = smd 0.66 x 2.032: 1 -4.445,-3.073; 2 -3.175,-3.073; 3 -1.905,-3.073; 4 -0.635,-3.073; 5 0.635,-3.073; 6 1.905,-3.073; 7 3.175,-3.073; 8 4.445,-3.073; 9 4.445,3.073; 10 3.175,3.073; 11 1.905,3.073; 12 0.635,3.073; 13 -0.635,3.073; 14 -1.905,3.073; 15 -3.175,3.073; 16 -4.445,3.073
ASE = smd 0.9 x 0.65: 1 -1.05,-0.825; 2 1.05,-0.825; 3 1.05,0.825; 4 -1.05,0.825
PROGRAM_PAK = hole 7.62: 0,1.27; 0,0 | hole 3.556: -22.86,-24.13; 22.86,-24.13
R1206 = smd 1.6 x 1.803: 1 -1.422,0; 2 1.422,0
R0402 = smd 0.7 x 0.9: 1 -0.65,0; 2 0.65,0
LED3MM = drill 0.813 octagon: A -1.27,0; K 1.27,0
SOT223 = smd 1.219 x 2.235: 1 -2.311,-3.099; 2 0,-3.099; 3 2.311,-3.099 | smd 3.6 x 2.2: 4 0,3.099
MA20-2 = smd 1.27 x 8.89: 1 -24.13,-0.305; 3 -21.59,-0.305; 5 -19.05,-0.305; 7 -16.51,-0.305; 11 -11.43,-0.305; 13 -8.89,-0.305; 15 -6.35,-0.305; 17 -3.81,-0.305; 19 -1.27,-0.305; 21 1.27,-0.305; 23 3.81,-0.305; 25 6.35,-0.305; 27 8.89,-0.305; 29 11.43,-0.305; 31 13.97,-0.305; 33 16.51,-0.305; 35 19.05,-0.305; 37 21.59,-0.305; 39 24.13,-0.305 | smd 1.27 x 8.89 bottom: 2 -24.13,-0.305; 4 -21.59,-0.305; 6 -19.05,-0.305; 8 -16.51,-0.305; 10 -13.97,-0.305; 12 -11.43,-0.305; 14 -8.89,-0.305; 16 -6.35,-0.305; 18 -3.81,-0.305; 20 -1.27,-0.305; 22 1.27,-0.305; 24 3.81,-0.305; 26 6.35,-0.305; 28 8.89,-0.305; 30 11.43,-0.305; 32 13.97,-0.305; 34 16.51,-0.305; 36 19.05,-0.305; 38 21.59,-0.305; 40 24.13,-0.305 | smd 1.27 x 7.62: 9 -13.97,0.305
M09D = smd 1.7 x 3.5: 1 5.486,-6.045; 2 2.743,-6.045; 3 0,-6.045; 4 -2.743,-6.045; 5 -5.486,-6.045 | smd 1.7 x 3.5 bottom: 6 4.115,-6.045; 7 1.372,-6.045; 8 -1.372,-6.045; 9 -4.115,-6.045

### Placement (x,y rotation side)
3V3  35.56,21.27 0 bottom
$FF6X/$FF7X  16.51,34.61 180 top
$FFX8/$FFXC  16.51,37.78 180 top
AUTO_RTS  45.4,20.64 0 top
C1  6.35,46.99 0 top
C1.1  27.62,22.86 90 bottom
C1.2  33.02,17.46 180 bottom
C1.3  33.02,28.26 0 bottom
C1.4  38.42,22.86 90 bottom
C2  10.16,46.99 0 top
C2.1  44.13,65.41 180 bottom
C3  3.81,51.44 90 top
C3.1  20.32,54.61 270 top
C4  13.97,46.99 180 top
C4.1  3.81,54.61 270 top
C5  22.86,46.99 0 top
C6  26.67,46.99 0 top
C7  20.32,51.44 90 top
C8  30.48,46.99 180 top
C9  5.08,37.78 90 top
C13  7.62,37.78 90 top
C14  20.96,32.39 90 bottom
CFG2  16.51,31.43 180 top
CTS  8.89,62.23 90 top
DCD_SEL  39.69,64.14 180 bottom
DSR  5.08,62.23 90 top
DSR_SEL  39.69,61.59 0 bottom
GND  33.02,18.73 0 bottom
GOLD_ORB_SM1  10.16,17.15 0 top
IC1  33.02,22.86 270 top
IC2  43.5,48.9 90 top
IC3  26.67,52.07 0 top
IC4  10.16,52.07 0 top
OSC1  24.13,32.39 180 bottom
PAK  26.67,42.55 0 top
R1  20.32,62.23 0 bottom
R2  6.35,57.15 0 bottom
R3  24.13,59.69 0 bottom
R4  12.7,34.61 180 top
R5  12.7,37.78 180 top
R6  12.7,41.91 180 top
R7  12.7,40.64 180 top
R8  12.7,31.43 180 top
R9  48.9,40.01 180 bottom
R10  48.9,26.67 90 top
RXD  12.7,64.77 0 top
TCK  30.48,18.73 0 bottom
TDI  30.48,21.27 0 bottom
TDO  35.56,18.73 0 bottom
TMS  33.02,21.27 0 bottom
TXD  1.27,64.77 90 top
VR1  7.62,31.12 180 top
X1  26.67,5.08 0 top
X2  26.67,71.44 0 top

### Tracks (layer width: path | path; a pad name or v marks a point on that pad's centre or on a via)
!BCS
  Top 0.152: IC2.3 47.62,33.97 47.62,27.62 42.61,22.61 IC1.56
!BRTS
  Top 0.152: IC1.8 33.27,49.28 28.58,53.98 IC3.11
!CART  (via drill 0.3)
  Top 0.152: v10.16,11.43 10.16,16.83 22.54,29.21 v26.04,29.21
  Bottom 0.152: X1.8 v10.16,11.43 | v26.04,29.21 34.29,37.47 IC2.26
!RESET  (via drill 0.3)
  Top 0.152: X1.5 7.62,10.16 8.89,11.43 8.89,16.83 21.91,29.85 v27.94,29.85 | IC2.4 v47.94,40.01 | v39.05,28.89 39.05,26.94 IC1.64
  Bottom 0.152: v39.05,28.89 38.1,29.85 34.29,29.85 | 34.29,29.85 v27.94,29.85 | R9.1 47.93,40.01 41.58,33.66 34.93,33.66 34.29,33.02 34.29,29.85
  Bottom 0.305: v47.94,40.01 R9.1
!RTS
  Top 0.152: IC1.58 41.71,23.61 46.36,28.26 46.36,45.4 IC2.8
!SCS  (via drill 0.3)
  Top 0.152: v45.72,11.43 44.45,12.7 39.37,12.7 36.27,15.8 IC1.47
  Bottom 0.152: v45.72,11.43 X1.36
!SLENB  (via drill 0.3)
  Top 0.152: v50.8,11.43 42.12,20.11 IC1.51
  Bottom 0.152: v50.8,11.43 X1.40
+3V3  (via drill 0.3, 0.6)
  Top 0.152: R5.2 R4.2 R8.2 12.05,31.73 12.07,31.75
  Top 0.305: IC1.3 v35.77,27.3 35.77,22.11 | 35.56,22.11 v28.58,22.11 IC1.26 | 35.56,22.11 35.77,22.11 | 35.77,22.11 IC1.55 | 35.56,22.11 3V3.TP 34.61,20.32 33.34,20.32 v31.75,18.73 31.27,18.25 IC1.37
  Top 0.61: C13.1 7.62,34.61 | R8.2 7.62,31.43 | 7.62,31.43 VR1.2 | 7.62,31.43 VR1.4
  Bottom 0.152: C1.3.1 33.67,27.93
  Bottom 0.305: 33.67,27.93 34.29,27.3 v35.77,27.3 | C1.2.1 31.75,18.08 v31.75,18.73 | C14.1 23.08,31.73 OSC1.4 23.08,25.5 26.22,22.36 27.62,22.36 | 27.62,22.36 28.58,22.36 v28.58,22.11 | C1.4.1 35.56,22.21 3V3.TP | C1.1.1 27.62,22.36
  Bottom 0.61: C14.1 20.65,31.43 R8.2
  other vias: 12.05,31.43 35.56,21.27
  pour Top: 6.03,35.24 9.21,35.24 9.21,32.7 11.43,32.7 11.43,20.64 5.4,14.61 3.81,14.61 3.81,32.7 6.03,32.7
ACIA_DCD
  Bottom 0.152: IC2.16 39.37,62.87 39.69,63.18 DCD_SEL.2
ACIA_DSR
  Bottom 0.152: IC2.17 39.37,60.33 39.69,60.64 DSR_SEL.2
ADDR0  (via drill 0.3)
  Top 0.152: X1.19 25.4,10.16 v26.67,11.43 29.27,14.03 IC1.33 | IC2.13 44.45,56.2 v44.45,30.16
  Bottom 0.152: v44.45,30.16 44.45,24.45 33.66,13.65 28.89,13.65 v26.67,11.43
ADDR1  (via drill 0.3)
  Top 0.152: v25.4,11.43 25.4,18.1 26.41,19.11 IC1.32 | IC2.14 43.81,58.1 v43.81,30.8
  Bottom 0.152: X1.20 v25.4,11.43 28.26,14.29 33.34,14.29 43.81,24.77 v43.81,30.8
ADDR2
  Top 0.152: X1.21 27.94,10.16 30.27,12.49 IC1.35
ADDR3  (via drill 0.3)
  Top 0.152: IC1.34 29.77,13.26 v27.94,11.43
  Bottom 0.152: X1.22 v27.94,11.43
ADDR4
  Top 0.152: 30.52,4.82 X1.23 30.48,10.16 31.77,11.45 IC1.38
ADDR5  (via drill 0.3)
  Top 0.152: 30.52,11.47 v30.48,11.43 30.77,11.72 IC1.36
  Bottom 0.152: v30.48,11.43 X1.24
ADDR6
  Top 0.152: X1.25 33.02,10.16 32.27,10.91 IC1.39
ADDR7  (via drill 0.3)
  Top 0.152: IC1.40 32.77,11.68 v33.02,11.43
  Bottom 0.152: v33.02,11.43 X1.26
ADDR8
  Top 0.152: X1.27 35.56,10.16 33.77,11.95 IC1.42
ADDR9  (via drill 0.3)
  Top 0.152: IC1.43 34.27,12.72 v35.56,11.43
  Bottom 0.152: v35.56,11.43 X1.28
ADDR10
  Top 0.152: X1.29 38.1,10.16 34.77,13.49 IC1.44
ADDR11  (via drill 0.3)
  Top 0.152: IC1.45 35.27,14.26 v38.1,11.43
  Bottom 0.152: v38.1,11.43 X1.30
ADDR12
  Top 0.152: X1.31 40.64,10.16 35.77,15.03 IC1.46
ADDR13
  Top 0.152: X1.37 48.26,10.16 44.45,13.97 39.37,13.97 36.77,16.57 IC1.48
ADDR14  (via drill 0.3)
  Top 0.152: v48.26,11.43 40.58,19.11 IC1.49
  Bottom 0.152: v48.26,11.43 X1.38
ADDR15
  Top 0.152: X1.39 50.8,10.16 41.35,19.61 IC1.50
BCLK
  Top 0.152: IC2.6 46.99,40.96 46.99,27.94 42.16,23.11 IC1.57
BD0
  Top 0.152: IC2.18 41.91,51.75 41.91,26.67 40.35,25.11 IC1.61
BD1
  Top 0.152: IC2.19 41.28,49.85 41.28,26.99 39.9,25.61 IC1.62
BD2
  Top 0.152: IC2.20 40.64,47.94 40.64,27.3 39.45,26.11 IC1.63
BD3
  Top 0.152: IC2.21 40.01,46.04 40.01,32.07 36.77,28.83 IC1.1
BD4
  Top 0.152: IC2.22 39.37,44.13 39.37,32.39 36.27,29.29 IC1.2
BD5
  Top 0.152: IC2.23 38.73,42.23 38.73,32.7 35.27,29.24 IC1.4
BD6
  Top 0.152: IC2.24 33.77,40.44 IC1.7
BD7
  Top 0.152: IC2.25 34.27,38.4 IC1.6
BPHI2
  Top 0.152: IC1.5 34.77,33.82 IC2.27
CONFIG0
  Top 0.152: IC1.11 31.77,29.51 23.5,37.78 $FFX8/$FFXC.1 17.15,37.91 17.15,38.73 16.51,39.37 13.97,39.37 13.35,38.75 R5.1
CONFIG1
  Top 0.152: IC1.12 31.27,29.37 26.04,34.61 $FF6X/$FF7X.1 17.15,34.73 17.15,35.56 16.51,36.2 13.97,36.2 13.35,35.58 R4.1
CONFIG2
  Top 0.152: IC1.13 30.77,29.24 28.58,31.43 17.78,31.43 | 17.78,31.43 CFG2.1 17.15,31.56 17.15,32.39 16.51,33.02 13.97,33.02 13.35,32.4 R8.1 | 17.78,31.75 17.78,31.43
CTS  (via drill 0.3)
  Top 0.152: v11.11,53.34 10.8,53.66 IC4.12
  Bottom 0.152: v11.11,53.34 13.02,51.44 49.85,51.44 IC2.9
DATA0  (via drill 0.3)
  Top 0.152: v12.7,11.43 12.7,16.83 21.98,26.11 IC1.18
  Bottom 0.152: X1.10 v12.7,11.43
DATA1
  Top 0.152: X1.11 15.24,10.16 16.51,11.43 16.51,18.1 23.52,25.11 IC1.20
DATA2  (via drill 0.3)
  Top 0.152: v15.24,11.43 15.24,18.1 22.75,25.61 IC1.19
  Bottom 0.152: X1.12 v15.24,11.43
DATA3
  Top 0.152: X1.13 17.78,10.16 19.05,11.43 19.05,18.1 24.56,23.61 IC1.23
DATA4  (via drill 0.3)
  Top 0.152: v17.78,11.43 17.78,18.1 23.79,24.11 IC1.22
  Bottom 0.152: X1.14 v17.78,11.43
DATA5
  Top 0.152: X1.15 20.32,10.16 21.59,11.43 21.59,18.1 26.1,22.61 IC1.25
DATA6  (via drill 0.3)
  Top 0.152: v20.32,11.43 20.32,18.1 25.33,23.11 IC1.24
  Bottom 0.152: X1.16 v20.32,11.43
DATA7
  Top 0.152: X1.17 22.86,10.16 24.13,11.43 24.13,18.1 25.64,19.61 IC1.31
DCD  (via drill 0.3)
  Top 0.152: 31.12,56.2 IC3.9 v31.12,59.06
  Bottom 0.152: v31.12,59.06 31.12,60.01 32.7,61.59 | 32.7,61.59 35.24,64.14 DCD_SEL.1 | DSR_SEL.3 32.7,61.59
DSR  (via drill 0.3)
  Top 0.152: IC3.12 27.31,56.52 32.39,61.59 DSR_SEL.1
  Bottom 0.152: DSR_SEL.1 DCD_SEL.3
  other vias: 41.21,61.59
DTR  (via drill 0.3)
  Top 0.152: IC4.11 12.07,56.52 v12.7,57.15
  Bottom 0.152: IC2.11 49.85,56.52 34.93,56.52 34.29,57.15 v12.7,57.15
E  (via drill 0.3)
  Top 0.152: v7.62,11.43 7.62,16.83 21.27,30.48 28.58,30.48 29.77,29.29 IC1.15
  Bottom 0.152: X1.6 v7.62,11.43
GND  (via drill 0.3, 0.6, 0.76)
  Top 1.27: v43.18,11.43 X1.34
  Bottom 1.27: X1.34 v43.18,11.43
  other vias: 38.42,17.46 38.1,27.94 27.94,17.78 27.94,27.94 0.64,11.43 0.64,16.51 0.64,21.59 0.64,26.67 0.64,31.75 0.64,36.83 0.64,41.91 0.64,45.72 0.64,50.8 0.64,55.88 0.64,60.96 5.72,66.67 10.8,66.67 15.88,66.67 19.69,66.67 52.7,66.04 47.62,66.67 42.55,66.67 37.47,66.67 33.66,66.67 52.7,60.96 52.7,55.88 52.7,50.8 52.7,45.72 52.7,41.91 52.7,36.83 52.7,31.75 52.7,26.67 52.7,21.59 52.7,16.51 52.7,11.43 6.99,52.07 23.5,52.07 33.02,18.73
  pour Bottom (rank 2): 0,67.31 53.34,67.31 53.34,9.52 0,9.52
  pour Top (rank 2): 0,67.31 53.34,67.31 53.34,9.52 0,9.52
LED_RXD
  Top 0.152: IC1.9 32.77,29.78 20.64,41.91 R6.1
LED_TXD
  Top 0.152: IC1.10 32.27,29.64 21.27,40.64 R7.1
N$1  (via drill 0.6)
  Top 0.152: IC1.53 37.94,21.11 TDO.TP
  other vias: 35.56,18.73
N$2  (via drill 0.6)
  Top 0.152: IC1.28 30.32,21.11 TDI.TP
  other vias: 30.48,21.27
N$3  (via drill 0.6)
  Top 0.152: IC1.29 32.36,20.61 TMS.TP
  other vias: 33.02,21.27
N$4  (via drill 0.6)
  Top 0.152: IC1.30 29.1,20.11 TCK.TP
  other vias: 30.48,18.73
N$7  (via drill 0.3)
  Top 0.152: 26.16,26.86 v26.04,26.99 26.41,26.61 IC1.17
  Bottom 0.152: OSC1.3 25.18,27.84 v26.04,26.99
N$8
  Bottom 0.152: 40.96,64.14 40.01,64.14
N$9
  Bottom 0.152: 39.37,61.59 38.42,61.59
N$10
  Bottom 0.152: R2.2 3.81,57.15 3.18,57.79 3.18,61.59 3.81,62.23 DSR.2
N$11  (via drill 0.3)
  Top 0.152: IC3.7 29.85,50.16 29.21,50.8 25.4,50.8 24.13,52.07 v24.13,59.69
  Bottom 0.152: DSR.1 CTS.1 R3.2 v24.13,59.69
N$12
  Bottom 0.152: CTS.2 R1.2
N$13
  Top 0.61: IC4.1 5.72,47.01 C1.1
N$14
  Top 0.152: IC1.52 44.61,20.61 AUTO_RTS.1 44.64,21.77 R10.1
N$15
  Top 0.152: 45.09,20.64 45.72,20.64
N$16
  Top 0.152: 16.19,37.78 16.83,37.78
N$17
  Top 0.61: IC4.3 8.26,47.62 7.62,46.99 C1.2
N$18
  Top 0.61: IC4.4 9.53,47.01 C2.1
N$19
  Top 0.61: IC4.5 10.8,47.01 C2.2
N$20
  Top 0.61: C3.1 6.37,50.79 6.99,50.16 IC4.2
N$21
  Top 0.61: IC4.6 12.07,47.62 12.7,46.99 C4.2
N$22
  Top 0.61: IC3.1 22.23,47.01 C5.1
N$23
  Top 0.61: IC3.3 24.77,47.62 24.13,46.99 C5.2
N$24
  Top 0.61: IC3.4 26.04,47.01 C6.1
N$25
  Top 0.152: 16.19,34.61 16.83,34.61
N$26  (via drill 0.3)
  Top 0.152: v7.62,43.18 10.16,40.64 R7.2
  Bottom 0.152: TXD.A 1.27,49.53 v7.62,43.18
N$27  (via drill 0.3)
  Top 0.152: v7.62,44.45 10.16,41.91 R6.2
  Bottom 0.152: RXD.A 10.16,66.04 3.81,66.04 2.54,64.77 2.54,49.53 v7.62,44.45
N$34
  Top 0.61: IC3.5 27.31,47.01 C6.2
N$36
  Top 0.61: C7.1 22.88,50.79 23.5,50.16 IC3.2
N$37
  Top 0.61: IC3.6 28.58,47.62 29.21,46.99 C8.2
Q
  Top 0.152: IC1.16 23.16,28.56 11.43,16.83 11.43,11.43 10.16,10.16 X1.7
R/!W  (via drill 0.3)
  Top 0.152: v22.86,11.43 22.86,18.1 26.37,21.61 IC1.27
  Bottom 0.152: X1.18 v22.86,11.43 26.35,14.92 33.02,14.92 43.18,25.08 43.18,26.99 37.78,32.39 IC2.28
RS_CTS  (via drill 0.3)
  Top 0.152: v24.13,62.23 15.56,62.23 9.53,56.2 IC4.13
  Bottom 0.152: X2.8 25.3,63.4 v24.13,62.23 R1.1
RS_DCD  (via drill 0.3)
  Top 0.152: v29.21,60.96 v26.04,57.79 IC3.13
  Bottom 0.152: R2.1 8.41,57.79 v26.04,57.79 | X2.6 30.79,62.53 v29.21,60.96
RS_DSR  (via drill 0.3)
  Top 0.152: X2.1 32.16,62.64 v30.48,60.96 26.67,57.15 26.67,53.98 28.58,52.07 29.21,52.07 31.12,50.16 IC3.8
  Bottom 0.152: R3.1 29.21,59.69 v30.48,60.96
RS_DTR
  Top 0.152: X2.4 23.93,63.3 23.5,62.87 14.92,62.87 8.26,56.2 | 8.26,56.2 IC4.14 | DSR.3 6.35,64.77 6.99,64.14 6.99,57.47 8.26,56.2
RS_RTS  (via drill 0.3)
  Top 0.152: v28.04,61.06 24.77,57.79 IC3.14
  Bottom 0.152: X2.7 v28.04,61.06 27.94,60.96 7.62,60.96 6.99,61.59 6.99,64.14 7.62,64.77 CTS.3
RS_RXD
  Top 0.152: X2.2 29.41,63.7 26.67,60.96 24.13,60.96 14.61,51.44 IC4.8
RS_TXD
  Top 0.152: X2.3 26.67,63.5 24.77,61.59 23.5,61.59 13.34,51.44 IC4.7
RXD  (via drill 0.3)
  Top 0.152: 14.82,54.93 IC4.9 14.61,56.52 v16.51,58.42 | IC2.12 45.09,54.29 45.09,28.89 40.8,24.61 IC1.60
  Bottom 0.152: IC2.12 49.85,59.06 34.93,59.06 34.29,58.42 v16.51,58.42
TXD  (via drill 0.3)
  Top 0.152: v13.97,53.34 13.34,53.98 IC4.10 | IC2.10 45.72,49.85 45.72,28.58 41.26,24.11 IC1.59
  Bottom 0.152: IC2.10 49.85,53.98 34.93,53.98 34.29,53.34 v13.97,53.34
VCC  (via drill 0.3)
  Top 0.152: IC2.2 48.9,32.7 R10.2 | 2.54,32.69 2.54,33.02
  Top 0.61: C4.1.1 5.6,55.26 IC4.16 5.72,52.09 C3.2 2.54,52.09 2.54,45.72 | C3.1.1 22.11,55.26 IC3.16 22.23,52.09 C7.2 19.05,52.09 v19.05,45.72 2.54,45.72 | X1.9 12.7,10.16 v13.97,11.43 | 2.54,45.72 2.54,34.29 | 2.54,34.29 2.54,33.02 v2.54,24.13 | IC2.15 42.86,65.41 v42.86,48.9 | VR1.3 5.23,34.29 | 5.23,34.29 2.54,34.29 | 5.23,34.29 5.23,36.83 C9.1
  Bottom 0.152: v42.86,48.9 49.53,48.9 49.53,40.01 | IC2.2 49.53,34.93 49.53,40.01 | R9.2 49.53,40.01
  Bottom 0.61: v13.97,11.43 13.97,12.7 v2.54,24.13 | v19.05,45.72 19.05,48.9 v42.86,48.9 | C2.1.1 IC2.15

### Text on the board
tNames: CocoLINK | (c)2016-18 RETRO Innovations / www.go4retro.com
bNames: DCD | DSR
tValues: DTR | RTS | HIGH | C:/Users/brain/projects/Link232/pcb/Link232.bmp